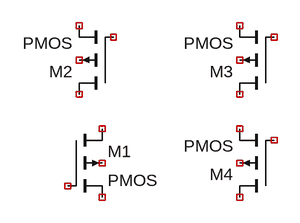
[diagram p0: schematic Draft1.asc]
Draft1.asc, the LTspice schematic file:
Version 4
SHEET 1 880 680
SYMBOL pmos4 224 144 R0
SYMATTR InstName M1
SYMBOL pmos4 288 96 R180
SYMATTR InstName M2
SYMBOL pmos4 512 96 R180
SYMATTR InstName M3
SYMBOL pmos4 512 240 R180
SYMATTR InstName M4

The netlist it stands for:
* Draft1.asc
M1 NC_01 NC_02 NC_03 NC_04 PMOS
M2 NC_05 NC_06 NC_07 NC_08 PMOS
M3 NC_09 NC_10 NC_11 NC_12 PMOS
M4 NC_13 NC_14 NC_15 NC_16 PMOS
.model NMOS NMOS
.model PMOS PMOS
.lib standard.mos
.backanno
.end